# Altium project GameController.PrjPcb
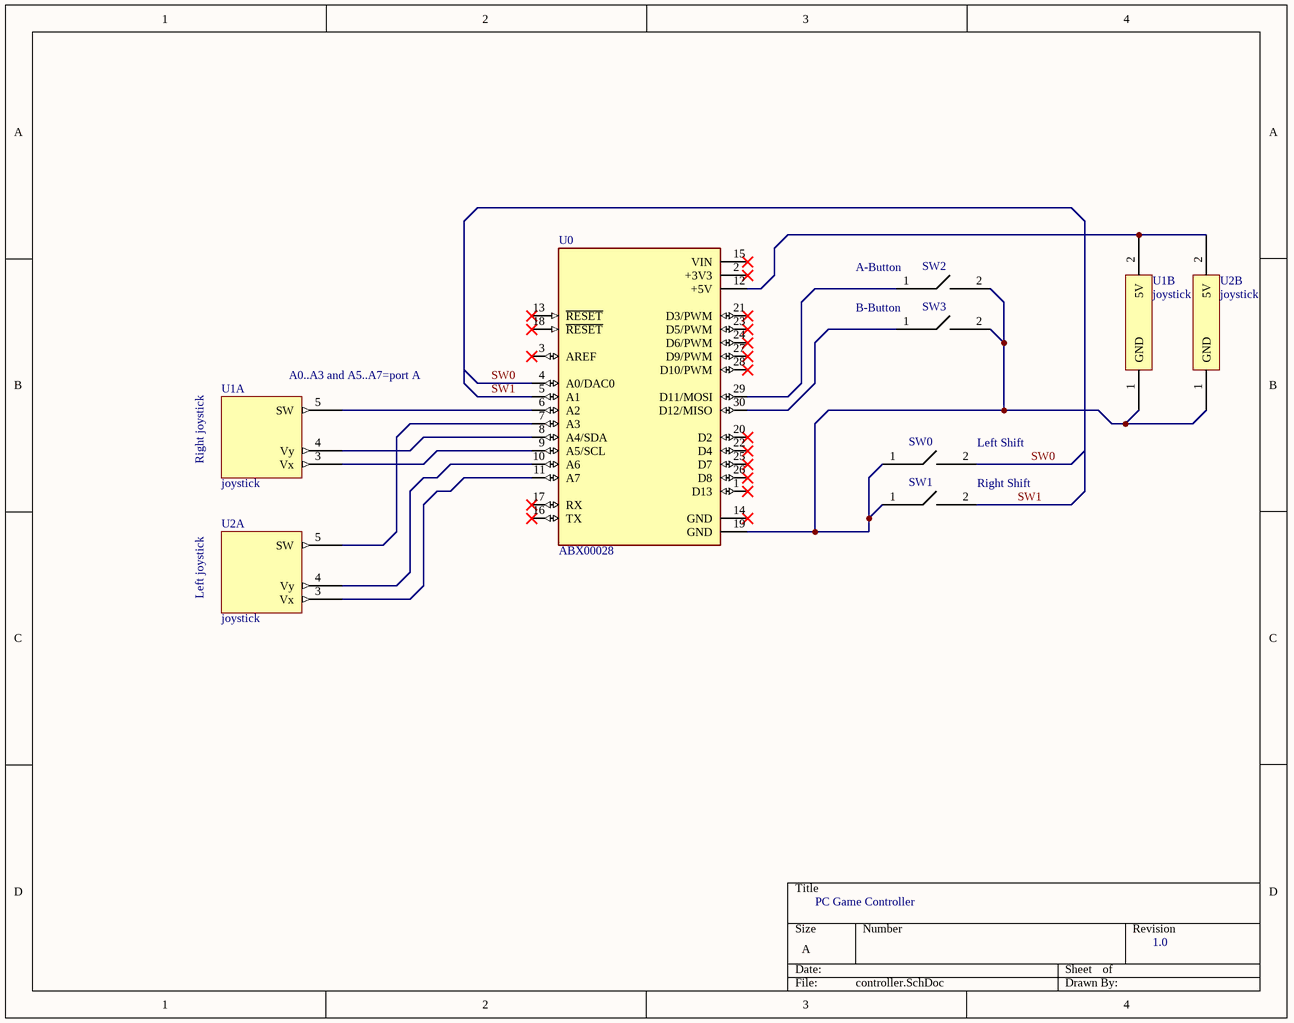
[diagram p0: controller.SchDoc]
1 sheet, 7 parts. Net scope: global (net labels, ports and power ports of the same name join across sheets).
Board file: controller.PcbDoc

## Sheet controller.SchDoc
size A; SheetNumber: 1; SheetTotal: 1

### Parts
SW0  (no value)  [temp switch]
SW1  (no value)  [temp switch]
SW2  (no value)  [temp switch]
SW3  (no value)  [temp switch]
U0  ABX00028  [MODULE_ABX00028]
U1  joystick  [joystick]  (parts A,B of 2)
U2  joystick  [joystick]  (parts A,B of 2)

### Nets
SW0: SW0.2 U0.4(A0/DAC0)
SW1: SW1.2 U0.5(A1)
NetSW0_1: SW0.1 SW1.1 SW2.2 SW3.2 U0.19(GND) U1.1(GND) U2.1(GND)
NetSW2_1: SW2.1 U0.29(D11/MOSI)
NetSW3_1: SW3.1 U0.30(D12/MISO)
NetU0_6: U0.6(A2) U1.5(SW)
NetU0_7: U0.7(A3) U2.5(SW)
NetU0_8: U0.8(A4/SDA) U1.4(Vy)
NetU0_9: U0.9(A5/SCL) U1.3(Vx)
NetU0_10: U0.10(A6) U2.4(Vy)
NetU0_11: U0.11(A7) U2.3(Vx)
NetU0_12: U0.12(+5V) U1.2(5V) U2.2(5V)

Not connected (* = marked no-connect by the designer): U0 1(D13)* 2(+3V3)* 3(AREF)* 13(~{RESET})* 14(GND)* 15(VIN)* 16(TX)* 17(RX)* 18(~{RESET})* 20(D2)* 21(D3/PWM)* 22(D4)* 23(D5/PWM)* 24(D6/PWM)* 25(D7)* 26(D8)* 27(D9/PWM)* 28(D10/PWM)*

### Notes on the sheet
- (near SW2) A-Button
- B-Button
- (near U1) A0..A3 and A5..A7=port A
- Right joystick
- Right Shift
- (near SW0) Left Shift
- Left joystick
- PC Game Controller
- 1.0

### Library data of the parts
SW0-SW3 = button
U0 = ABX00028: Arduinoâ€™s 5V compatible board in the smallest available form factor: 45x18mm!; MP: Arduino Nano Every; Check_prices: https://www.snapeda.com/parts/Arduino%20Nano%20Every/Arduino/view-part/?ref=eda; Value: *; Availability: Not in stock; Price: None; Package: None; SnapEDA_Link: https://www.snapeda.com/parts/Arduino%20Nano%20Every/Arduino/view-part/?ref=snap; MF: Arduino